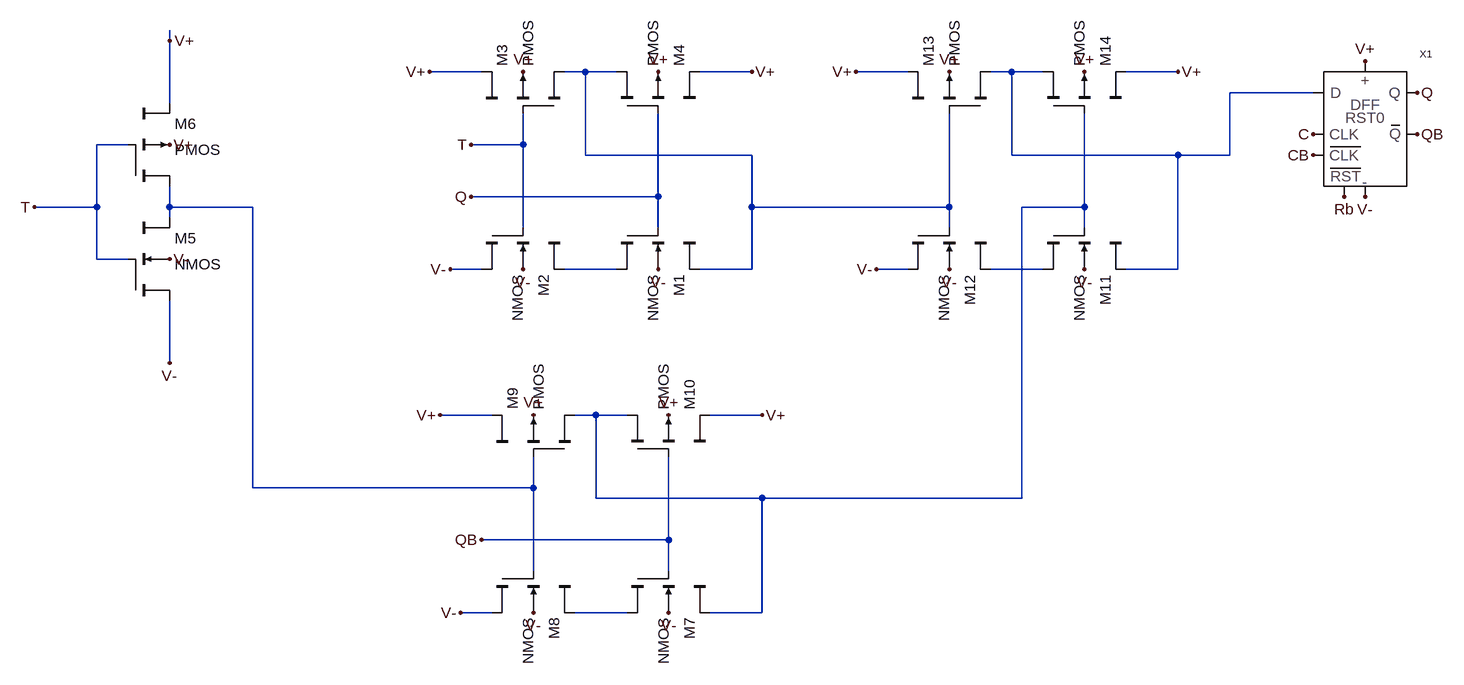
[diagram p0: schematic ToggleFlipFlop_Low_LDS_SYMBOL.asc]
ToggleFlipFlop_Low_LDS_SYMBOL.asc, the LTspice schematic file:
Version 4
SHEET 1 3292 1708
WIRE -1024 272 -1024 256
WIRE -544 320 -624 320
WIRE -384 320 -416 320
WIRE -336 320 -384 320
WIRE -128 320 -208 320
WIRE 112 320 32 320
WIRE 272 320 240 320
WIRE 320 320 272 320
WIRE 528 320 448 320
WIRE 736 352 608 352
WIRE -1024 368 -1024 272
WIRE -1088 432 -1136 432
WIRE -480 432 -480 384
WIRE -480 432 -560 432
WIRE -384 448 -384 320
WIRE -128 448 -384 448
WIRE 272 448 272 320
WIRE 528 448 272 448
WIRE 608 448 608 352
WIRE 608 448 528 448
WIRE -272 512 -272 384
WIRE -272 512 -560 512
WIRE -1136 528 -1136 432
WIRE -1136 528 -1232 528
WIRE -1024 528 -1024 496
WIRE -896 528 -1024 528
WIRE -128 528 -128 448
WIRE 176 528 176 384
WIRE 176 528 -128 528
WIRE 384 528 384 384
WIRE 384 528 288 528
WIRE -1024 544 -1024 528
WIRE -480 560 -480 432
WIRE -272 560 -272 512
WIRE 176 560 176 528
WIRE 384 560 384 528
WIRE -1136 608 -1136 528
WIRE -1088 608 -1136 608
WIRE -544 624 -592 624
WIRE -336 624 -416 624
WIRE -128 624 -128 528
WIRE -128 624 -208 624
WIRE 112 624 64 624
WIRE 320 624 240 624
WIRE 528 624 528 448
WIRE 528 624 448 624
WIRE -1024 768 -1024 672
WIRE -528 848 -608 848
WIRE -368 848 -400 848
WIRE -320 848 -368 848
WIRE -112 848 -192 848
WIRE -896 960 -896 528
WIRE -464 960 -464 912
WIRE -464 960 -896 960
WIRE -368 976 -368 848
WIRE -112 976 -368 976
WIRE 288 976 288 528
WIRE 288 976 -112 976
WIRE -256 1040 -256 912
WIRE -256 1040 -544 1040
WIRE -464 1088 -464 960
WIRE -256 1088 -256 1040
WIRE -528 1152 -576 1152
WIRE -320 1152 -400 1152
WIRE -112 1152 -112 976
WIRE -112 1152 -192 1152
FLAG -480 320 V+
FLAG -272 320 V+
FLAG -272 624 V-
FLAG -480 624 V-
FLAG -592 624 V-
FLAG -1024 272 V+
FLAG -1024 432 V+
FLAG -1024 768 V-
FLAG -1024 608 V-
FLAG -624 320 V+
FLAG -128 320 V+
FLAG -464 848 V+
FLAG -256 848 V+
FLAG -256 1152 V-
FLAG -464 1152 V-
FLAG -576 1152 V-
FLAG -608 848 V+
FLAG -112 848 V+
FLAG 176 320 V+
FLAG 384 320 V+
FLAG 384 624 V-
FLAG 176 624 V-
FLAG 64 624 V-
FLAG 32 320 V+
FLAG 528 320 V+
FLAG -560 512 Q
FLAG -544 1040 QB
FLAG -1232 528 T
FLAG -560 432 T
FLAG 736 416 C
FLAG 736 448 CB
FLAG 784 512 Rb
FLAG 816 304 V+
FLAG 816 512 V-
FLAG 896 352 Q
FLAG 896 416 QB
SYMBOL cktsym\\nmos4 -272 624 R90
SYMATTR InstName M1
SYMATTR Value2 l=0.9u w=3u
SYMBOL cktsym\\nmos4 -480 624 R90
SYMATTR InstName M2
SYMATTR Value2 l=0.9u w=3u
SYMBOL cktsym\\pmos4 -480 320 R270
SYMATTR InstName M3
SYMATTR Value2 l=0.9u w=6u
SYMBOL cktsym\\pmos4 -272 320 M270
SYMATTR InstName M4
SYMATTR Value2 l=0.9u w=6u
SYMBOL cktsym\\nmos4 -1024 608 R0
SYMATTR InstName M5
SYMATTR Value2 l=0.9u w=3u
SYMBOL cktsym\\pmos4 -1024 432 R0
SYMATTR InstName M6
SYMATTR Value2 l=0.9u w=6u
SYMBOL cktsym\\nmos4 -256 1152 R90
SYMATTR InstName M7
SYMATTR Value2 l=0.9u w=3u
SYMBOL cktsym\\nmos4 -464 1152 R90
SYMATTR InstName M8
SYMATTR Value2 l=0.9u w=3u
SYMBOL cktsym\\pmos4 -464 848 R270
SYMATTR InstName M9
SYMATTR Value2 l=0.9u w=6u
SYMBOL cktsym\\pmos4 -256 848 M270
SYMATTR InstName M10
SYMATTR Value2 l=0.9u w=6u
SYMBOL cktsym\\nmos4 384 624 R90
SYMATTR InstName M11
SYMATTR Value2 l=0.9u w=3u
SYMBOL cktsym\\nmos4 176 624 R90
SYMATTR InstName M12
SYMATTR Value2 l=0.9u w=3u
SYMBOL cktsym\\pmos4 176 320 R270
SYMATTR InstName M13
SYMATTR Value2 l=0.9u w=6u
SYMBOL cktsym\\pmos4 384 320 M270
SYMATTR InstName M14
SYMATTR Value2 l=0.9u w=6u
SYMBOL ResetFlipFlop_Low_LDS 816 416 R0
SYMATTR InstName X1

The netlist it stands for:
* ToggleFlipFlop_Low_LDS_SYMBOL.asc
M1 N001 Q N005 V- NMOS l=0.9u w=3u
M2 N005 T V- V- NMOS l=0.9u w=3u
M3 N001 T V+ V+ PMOS l=0.9u w=6u
M4 N001 Q V+ V+ PMOS l=0.9u w=6u
M5 N003 T V- V- NMOS l=0.9u w=3u
M6 N003 T V+ V+ PMOS l=0.9u w=6u
M7 N004 QB N007 V- NMOS l=0.9u w=3u
M8 N007 N003 V- V- NMOS l=0.9u w=3u
M9 N004 N003 V+ V+ PMOS l=0.9u w=6u
M10 N004 QB V+ V+ PMOS l=0.9u w=6u
M11 N002 N004 N006 V- NMOS l=0.9u w=3u
M12 N006 N001 V- V- NMOS l=0.9u w=3u
M13 N002 N001 V+ V+ PMOS l=0.9u w=6u
M14 N002 N004 V+ V+ PMOS l=0.9u w=6u
XX1 N002 C CB Q QB Rb V+ V- ResetFlipFlop_Low_LDS  ; pins D CLK CLKb Q Qb RESETb pos neg
.model NMOS NMOS
.model PMOS PMOS
.lib standard.mos
.backanno
.end